# Altium project AuxPowerSupply.PrjPcb (part 3 of 3)

## Sheet OverCurrent_Indicators.SchDoc: Overcurrent Protection
size A4; CheckedBy: G.Kasprowicz; Author: M.Gaska; CompanyName: WUT ISE; DrawnBy: M.Gaska; Organization: WUT ISE; Address1: PW ISE; Address2: Nowowiejska 15/19 00-665 Warsaw; Address3: michalgaska2@gmail.com; DocumentNumber: 8; Revision: 2.0; SheetNumber: 8; SheetTotal: 9; ModifiedBy: M. Fafara; CheckedDate: -; Title2: v2.0; DivGrp: WUT ISE; Designer: M.Gaska; ModifiedDate: -; ProjectName: Sensor Box
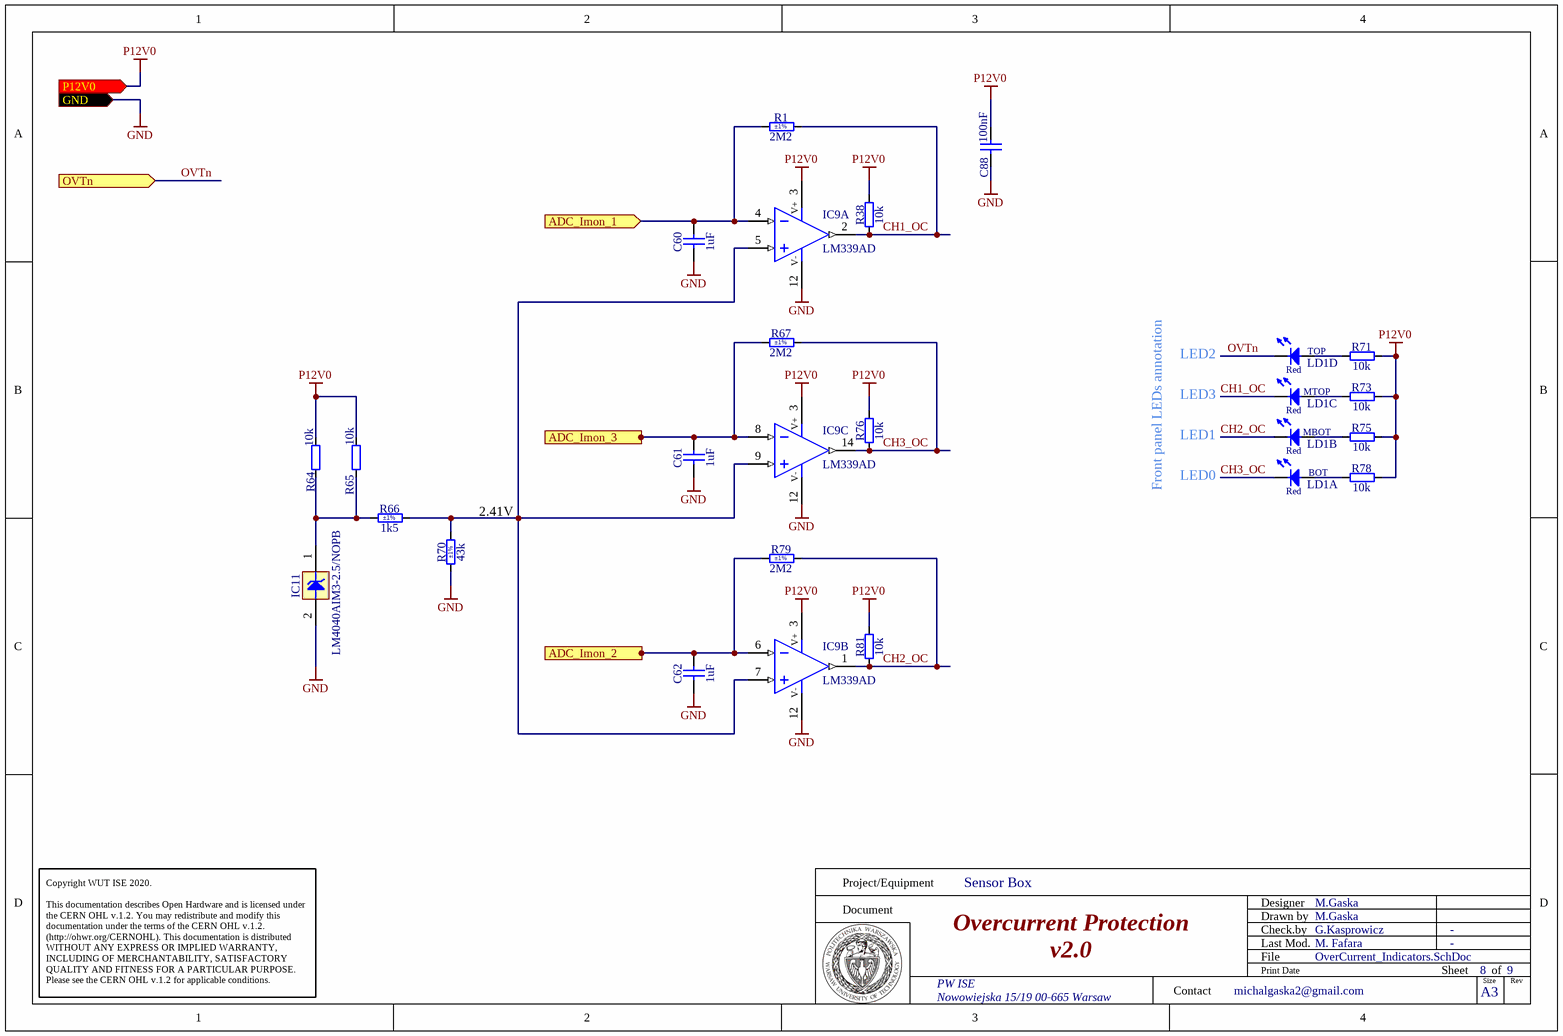
[diagram p5: OverCurrent_Indicators.SchDoc]

### Parts
C60  1uF  [CAPC1608X87N]
C61  1uF  [CAPC1608X87N]
C62  1uF  [CAPC1608X87N]
C88  100nF  [CAPC1608X87N]
IC9  LM339AD  [SOIC127P600X175-14N]  (parts A,B,C of 4)
IC11  LM4040AIM3-2.5/NOPB  [SOT95P251X112-3N]
LD1  (no value)  [LED_BIVAR_H485CHDL]  (parts A,B,C,D of 4)
R1  2M2  Tolerance: ±1%  [RESC1608X55N]
R38  10k  [RESC1608X55N]
R64  10k  [RESC1608X55N]
R65  10k  [RESC1608X55N]
R66  1k5  Tolerance: ±1%  [RESC1608X55N]
R67  2M2  Tolerance: ±1%  [RESC1608X55N]
R70  43k  Tolerance: ±1%  [RESC1608X55N]
R71  10k  [RESC1608X55N]
R73  10k  [RESC1608X55N]
R75  10k  [RESC1608X55N]
R76  10k  [RESC1608X55N]
R78  10k  [RESC1608X55N]
R79  2M2  Tolerance: ±1%  [RESC1608X55N]
R81  10k  [RESC1608X55N]

### Ports
ADC_Imon_1 (in), ADC_Imon_2 (in), ADC_Imon_3 (in), GND (in), OVTn (in), P12V0 (in)

### Nets
GND: C60.1 C61.1 C62.1 C88.1 IC9.12(V-) IC11.2(A) R70.1 ; port GND
P12V0: C88.2 IC9.3(V+) R38.2 R64.2 R65.2 R71.1 R73.1 R75.1 R76.2 R78.1 R81.2 ; port P12V0
ADC_Imon_1: C60.2 IC9.4(IN-) R1.1 ; port ADC_Imon_1
ADC_Imon_2: C62.2 IC9.6(IN-) R79.1 ; port ADC_Imon_2
ADC_Imon_3: C61.2 IC9.8(IN-) R67.1 ; port ADC_Imon_3
CH1_OC: IC9.2(OUT) LD1.5(C) R1.2 R38.1
CH2_OC: IC9.1(OUT) LD1.3(C) R79.2 R81.1
CH3_OC: IC9.14(OUT) LD1.1(C) R67.2 R76.1
OVTn: LD1.7(C) ; port OVTn
NetIC9_5: IC9.5(IN+) IC9.7(IN+) IC9.9(IN+) R66.2 R70.2
NetIC11_1: IC11.1(C) R64.1 R65.1 R66.1
NetLD1_2: LD1.2(A) R78.2
NetLD1_4: LD1.4(A) R75.2
NetLD1_6: LD1.6(A) R73.2
NetLD1_8: LD1.8(A) R71.2

### Notes on the sheet
- LED2
- LED1
- LED3
- (near R70) 2.41V
- Front panel LEDs annotation
- LED0
- Project/Equipment
- Document
- Designer
- Drawn by
- Check.by
- Copyright WUT ISE 2020.
  This documentation describes Open Hardware and is licensed under the CERN OHL v.1.2. You may redistribute and modify this documentation under the terms of the CERN OHL v.1.2. (http://ohwr.org/CERNOHL). This documentation is distributed WITHOUT ANY EXPRESS OR IMPLIED WARRANTY, INCLUDING OF MERCHANTABILITY, SATISFACTORY QUALITY AND FITNESS FOR A PARTICULAR PURPOSE. Please see the CERN OHL v.1.2 for applicable conditions.
- Contact
- File
- Last Mod.
- Print Date
- Sheet
- Size
- A3
- of
- Rev
- (in symbol LED_BIVAR_H485CHDL, part A) BOT; Red
- (in symbol LED_BIVAR_H485CHDL, part B) MBOT; Red
- (in symbol LED_BIVAR_H485CHDL, part C) MTOP; Red
- (in symbol LED_BIVAR_H485CHDL, part D) TOP; Red

### Library data of the parts
C60-C62 = CC0603_1UF_25V_10%_X7R: as C83 on sheet AuxPowerSupply; Part Number: CC0603_1UF_25V_10%_X7R; Component Kind: Standard; Component Type: Standard; Pin Count: 2; Value: 1uF; Status: None; Manufacturer Part Number: CC0603_1UF_25V_10%_X7R; Case: 0603; Mounted: Yes; Socket: No; SMD: Yes; Sense: No; Manufacturer1 Example: MURATA; Manufacturer1 ComponentHeight: 0.9mm; HelpURL: \\cern.ch\dfs\Applications\Altium\Datasheets\CC0603_X7R_MURATA.pdf; Author: CERN DEM JLC; CreateDate: 18.01.2011; LatestRevisionDate: 18.01.2011
C88 = CC0603_100NF_50V_10%_X7R: as C78 on sheet Negative_Rail; Part Number: CC0603_100NF_50V_10%_X7R; Component Kind: Standard; Component Type: Standard; Pin Count: 2; Value: 100nF; Status: Preferred; Manufacturer Part Number: CC0603_100NF_50V_10%_X7R; Case: 0603; Mounted: Yes; Socket: No; SMD: Yes; Sense: No; Manufacturer1 Example: PHYCOMP; Manufacturer1 ComponentHeight: 0.87mm; HelpURL: \\cern.ch\dfs\Applications\Altium\Datasheets\CC0603_X7R_PHYCOMP.pdf; Author: CERN DEM JLC; CreateDate: 03.12.2007; LatestRevisionDate: 03.12.2007
IC9 = LM339AD: Quad Operational Amplifier; Part Description: Quad Differential Comparator; Manufacturer: TEXAS INSTRUMENTS; PressFit: No; Bonding: No; Part Number: LM339AD; Component Kind: Standard; Component Type: Standard; Device: LM339AD; PackageDescription: SOIC 14, Pitch 1.27mm - Body 4x8.75mm, IPC Medium Density; Manufacturer Part Number: LM339AD; Pin Count: 14; Case: SOIC14; Mounted: Yes; Socket: No; SMD: Yes; Sense: No; ComponentHeight: 1.75mm; Author: CERN DEM JLC; HelpURL: \\cern.ch\dfs\Applications\Altium\Datasheets\LM339AD.pdf; CreateDate: 09.03.2011; LatestRevisionDate: 09.03.2011
IC11 = LM4040AIM3-2.5/NOPB: Precision Micropower Shunt Voltage Reference; Part Description: 2.5V ±0.1% 100 ppm/°C Precision Micropower Shunt Voltage Reference; Manufacturer: TEXAS INSTRUMENTS; PressFit: No; Bonding: No; Part Number: LM4040AIM3-2.5/NOPB; Component Kind: Standard; Component Type: Standard; Device: LM4040AIM3-2.5/NOPB; PackageDescription: SOT23 3-Leads, Pitch 0.95mm - Body 1.3x2.9mm, IPC Medium Density; Manufacturer Part Number: LM4040AIM3-2.5; Pin Count: 2; Case: SOT23; Mounted: Yes; Socket: No; SMD: Yes; Sense: No; ComponentHeight: 1.12mm; HelpURL: \\cern.ch\dfs\Applications\Altium\Datasheets\LM4040AIM3-2.5-NOPB.pdf; Author: CERN DEM JLC; CreateDate: 30.03.2010; LatestRevisionDate: 01.06.2022
LD1 = LED_BIVAR_H485CHDL: LED x4 Red 1C2A-BOT_3C4A_5C6A_7C8A-TOP; Part Description: Quad-Level 2mm HE Red LED, PCB Edge Mounting; Manufacturer: BIVAR; Color: HE Red; PressFit: No; Bonding: No; Part Number: LED_BIVAR_H485CHDL; Component Kind: Standard; Component Type: Standard; PackageDescription: Quad-Level 2mm HE Red, PCB Edge Mounting  BIVAR H485CHDL; Manufacturer Part Number: H485CHDL; Pin Count: 8; Mounted: Yes; Socket: No; SMD: No; Sense: No; ComponentHeight: 11.3mm; HelpURL: \\cern.ch\dfs\Applications\Altium\Datasheets\LED_BIVAR_H485CHDL.pdf; Author: CERN DEM JLC; CreateDate: 11.12.2008; LatestRevisionDate: 04.06.2012
R1 R67 R79 = R0603_2M2_1%_0.1W_100PPM: Resistor - 1%; Part Description: General Purpose Thick Film Chip Resistor; Manufacturer: GENERIC; Manufacturer1 Part Number: NRC06F2204TRF; Power: 0.1W; TC: ±100ppm/°C; PressFit: No; Part Number: R0603_2M2_1%_0.1W_100PPM; Component Kind: Standard; Component Type: Standard; Pin Count: 2; Value: 2M2; Status: Preferred; Manufacturer Part Number: R0603_2M2_1%_0.1W_100PPM; Case: 0603; Mounted: Yes; Sense: No; Socket: No; SMD: Yes; Manufacturer1 Example: NIC COMPONENT; Manufacturer1 ComponentHeight: 0.55mm; HelpURL: \\cern.ch\dfs\Applications\Altium\Datasheets\R0603_NIC_NRC.pdf; Author: CERN DEM JLC; CreateDate: 03.12.2007; LatestRevisionDate: 13.03.2008
R38 R64 R65 R71 R73 R75 R76 R78 R81 = R0603_10K_1%_0.1W_100PPM: as R19 on sheet AuxPowerSupply; Part Number: R0603_10K_1%_0.1W_100PPM; Component Kind: Standard; Component Type: Standard; Pin Count: 2; Value: 10k; Status: Preferred; Tolerance: ±1%; Manufacturer Part Number: R0603_10K_1%_0.1W_100PPM; Case: 0603; Mounted: Yes; Sense: No; Socket: No; SMD: Yes; Manufacturer1 Example: NIC COMPONENT; Manufacturer1 ComponentHeight: 0.55mm; HelpURL: \\cern.ch\dfs\Applications\Altium\Datasheets\R0603_NIC_NRC.pdf; Author: CERN DEM JLC; CreateDate: 03.12.2007; LatestRevisionDate: 13.03.2008
R66 = R0603_1K5_1%_0.1W_100PPM: Resistor - 1%; Part Description: General Purpose Thick Film Chip Resistor; Manufacturer: GENERIC; Manufacturer1 Part Number: NRC06F1501TRF; Power: 0.1W; TC: ±100ppm/°C; PressFit: No; Part Number: R0603_1K5_1%_0.1W_100PPM; Component Kind: Standard; Component Type: Standard; Pin Count: 2; Value: 1k5; Status: Preferred; Manufacturer Part Number: R0603_1K5_1%_0.1W_100PPM; Case: 0603; Mounted: Yes; Sense: No; Socket: No; SMD: Yes; Manufacturer1 Example: NIC COMPONENT; Manufacturer1 ComponentHeight: 0.55mm; HelpURL: \\cern.ch\dfs\Applications\Altium\Datasheets\R0603_NIC_NRC.pdf; Author: CERN DEM JLC; CreateDate: 03.12.2007; LatestRevisionDate: 13.03.2008
R70 = R0603_43K_1%_0.1W_100PPM: Resistor - 1%; Part Description: General Purpose Thick Film Chip Resistor; Manufacturer: GENERIC; Manufacturer1 Part Number: NRC06F4302TRF; Power: 0.1W; TC: ±100ppm/°C; PressFit: No; Part Number: R0603_43K_1%_0.1W_100PPM; Component Kind: Standard; Component Type: Standard; Pin Count: 2; Value: 43k; Status: Preferred; Manufacturer Part Number: R0603_43K_1%_0.1W_100PPM; Case: 0603; Mounted: Yes; Sense: No; Socket: No; SMD: Yes; Manufacturer1 Example: NIC COMPONENT; Manufacturer1 ComponentHeight: 0.55mm; HelpURL: \\cern.ch\dfs\Applications\Altium\Datasheets\R0603_NIC_NRC.pdf; Author: CERN DEM JLC; CreateDate: 03.12.2007; LatestRevisionDate: 13.03.2008

## Sheet Front_PowerConnectors.SchDoc: Front Power Connectors
size A4; CheckedBy: G.Kasprowicz; Author: M.Gaska; CompanyName: WUT ISE; DrawnBy: M.Gaska; Organization: WUT ISE; Address1: PW ISE; Address2: Nowowiejska 15/19 00-665 Warsaw; Address3: gkasprow@gmail.com; DocumentNumber: 9; Revision: 2.0; SheetNumber: 9; SheetTotal: 9; ModifiedBy: M. Fafara; CheckedDate: -; Title2: v2.0; DivGrp: WUT ISE; Designer: M.Gaska; ModifiedDate: -; ProjectName: Sensor Box
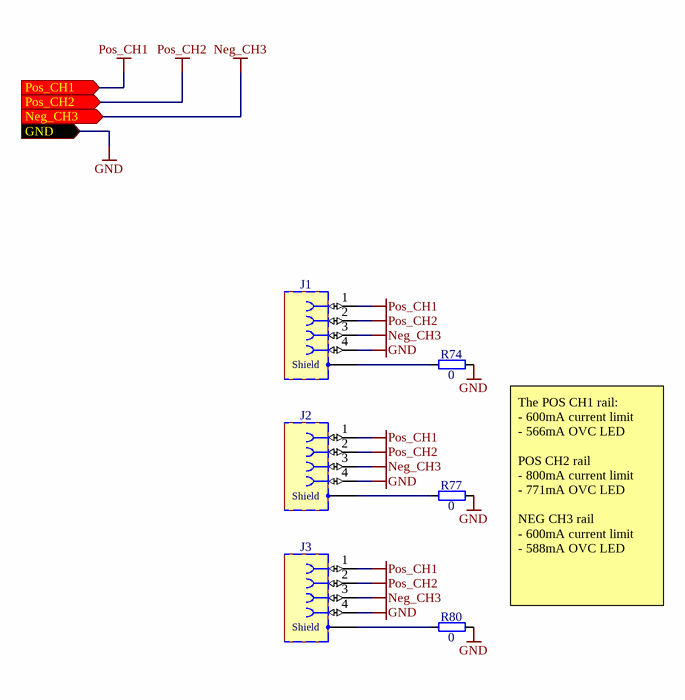
[diagram p6: Front_PowerConnectors.SchDoc]

### Parts
J1  M8  [AMPHENOL_M8AS-04PFFR-SF8001]  (value not drawn)
J2  M8  [AMPHENOL_M8AS-04PFFR-SF8001]  (value not drawn)
J3  M8  [AMPHENOL_M8AS-04PFFR-SF8001]  (value not drawn)
R74  0  [RESC1608X55N]
R77  0  [RESC1608X55N]
R80  0  [RESC1608X55N]

### Ports
GND (in), Neg_CH3 (in), Pos_CH1 (in), Pos_CH2 (in)

### Nets
GND: J1.4 J2.4 J3.4 R74.1 R77.1 R80.1 ; port GND
Neg_CH3: J1.3 J2.3 J3.3 ; port Neg_CH3
POS_CH1: J1.1 J2.1 J3.1 ; port Pos_CH1
POS_CH2: J1.2 J2.2 J3.2 ; port Pos_CH2
NetJ1_SHIELD: J1.SHIELD R74.2
NetJ2_SHIELD: J2.SHIELD R77.2
NetJ3_SHIELD: J3.SHIELD R80.2

### Notes on the sheet
- The POS CH1 rail:
  - 600mA current limit
  - 566mA OVC LED
  POS CH2 rail
  - 800mA current limit
  - 771mA OVC LED
  NEG CH3 rail
  - 600mA current limit
  - 588mA OVC LED
- Project/Equipment
- Document
- Designer
- Drawn by
- Check.by
- Copyright WUT ISE 2020.
  This documentation describes Open Hardware and is licensed under the CERN OHL v.1.2. You may redistribute and modify this documentation under the terms of the CERN OHL v.1.2. (http://ohwr.org/CERNOHL). This documentation is distributed WITHOUT ANY EXPRESS OR IMPLIED WARRANTY, INCLUDING OF MERCHANTABILITY, SATISFACTORY QUALITY AND FITNESS FOR A PARTICULAR PURPOSE. Please see the CERN OHL v.1.2 for applicable conditions.
- Contact
- File
- Last Mod.
- Print Date
- Sheet
- Size
- A3
- of
- Rev
- (in symbol AMPHENOL_M8AS-04PFFR-SF8001) Shield

### Library data of the parts
J1-J3 = AMPHENOL_M8AS-04PFFR-SF8001: Connector 4 Female + Shield; Part Description: 4 Contacts,  IP68 Sealing Level, Right Angled M8 Circular Receptacle; PressFit: No; Part Number: AMPHENOL_M8AS-04PFFR-SF8001; Component Kind: Standard; Component Type: Standard; Pin Count: 6; Family: M8; Mounted: Yes; Socket: No; SMD: No; Sense: No; Status: None; Manufacturer: AMPHENOL; Manufacturer Part Number: M8AS-04PFFR-SF8001; ComponentHeight: 12.65mm; HelpURL: \\cern.ch\dfs\Applications\Altium\Datasheets\AMPHENOL_M8AS-04PFFR-SF8001.pdf; Author: CERN DEM MR; CreateDate: 08.04.2019; LatestRevisionDate: 08.04.2019
R74 R77 R80 = R0603_0R_JUMPER: Resistor; Part Description: 1A (0.05R Max DC Resistance) Zero Ohm Jumper; Manufacturer: GENERIC; Manufacturer1 Part Number: NRC06Z0; PressFit: No; Part Number: R0603_0R_JUMPER; Component Kind: Standard; Component Type: Standard; Pin Count: 2; Value: 0; Status: Preferred; Manufacturer Part Number: R0603_0R_JUMPER; Case: 0603; Mounted: Yes; Sense: No; Socket: No; SMD: Yes; Manufacturer1 Example: NIC COMPONENT; Manufacturer1 ComponentHeight: 0.55mm; HelpURL: \\cern.ch\dfs\Applications\Altium\Datasheets\R0603_NIC_NRC.pdf; Author: CERN DEM JLC; CreateDate: 03.12.2007; LatestRevisionDate: 13.03.2008

## Sheet OverTempProtection.SchDoc: Over Temperature Protection
size A4; CheckedBy: G.Kasprowicz; Author: M.Gaska; CompanyName: WUT ISE; DrawnBy: M.Gaska; Organization: WUT ISE; Address1: PW ISE; Address2: Nowowiejska 15/19 00-665 Warsaw; Address3: michalgaska2@gmail.com; DocumentNumber: 8; Revision: 2.0; SheetNumber: 7; SheetTotal: 9; ModifiedBy: M. Fafara; CheckedDate: -; Title2: v2.0; DivGrp: WUT ISE; Designer: M.Gaska; ModifiedDate: -; ProjectName: Sensor Box
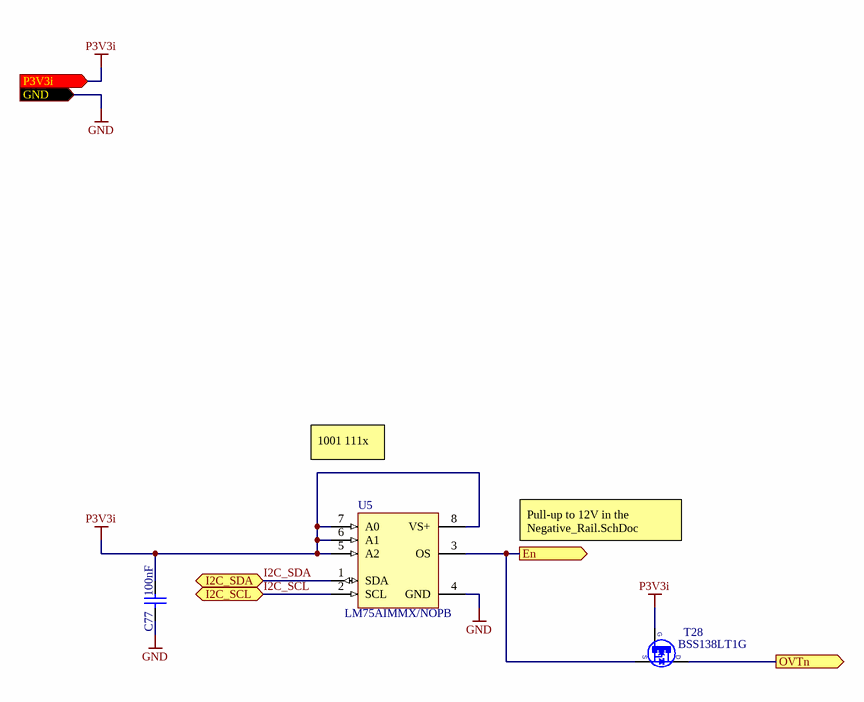
[diagram p7: OverTempProtection.SchDoc]

### Parts
C77  100nF  [CAPC1608X87N]
T28  BSS138LT1G  [SOT95P240X110-3N]
U5  LM75AIMMX/NOPB  [DGK0008A_M]

### Ports
En (out), GND (in), I2C_SCL (bidir), I2C_SDA (bidir), OVTn (out), P3V3i (in)

### Nets
GND: C77.1 U5.4(GND) ; port GND
P3V3i: C77.2 T28.1(G) U5.5(A2) U5.6(A1) U5.7(A0) U5.8(VS+) ; port P3V3i
En: T28.2(S) U5.3(OS) ; port En
I2C_SCL: U5.2(SCL) ; port I2C_SCL
I2C_SDA: U5.1(SDA) ; port I2C_SDA
OVTn: T28.3(D) ; port OVTn

### Notes on the sheet
- 1001 111x
- Pull-up to 12V in the Negative_Rail.SchDoc
- Project/Equipment
- Document
- Designer
- Drawn by
- Check.by
- Copyright WUT ISE 2020.
  This documentation describes Open Hardware and is licensed under the CERN OHL v.1.2. You may redistribute and modify this documentation under the terms of the CERN OHL v.1.2. (http://ohwr.org/CERNOHL). This documentation is distributed WITHOUT ANY EXPRESS OR IMPLIED WARRANTY, INCLUDING OF MERCHANTABILITY, SATISFACTORY QUALITY AND FITNESS FOR A PARTICULAR PURPOSE. Please see the CERN OHL v.1.2 for applicable conditions.
- Contact
- File
- Last Mod.
- Print Date
- Sheet
- Size
- A3
- of
- Rev

### Library data of the parts
C77 = CC0603_100NF_50V_10%_X7R: Non-polarised capacitor; Part Description: SMD Multilayer Chip Ceramic Capacitor; Manufacturer: GENERIC; Manufacturer1 Part Number: 223858615649; Voltage: 50V; TC: X7R; Tolerance: ±10%; Part Number: CC0603_100NF_50V_10%_X7R; Component Kind: Standard; Component Type: Standard; Pin Count: 2; Value: 100nF; Status: Preferred; Manufacturer Part Number: CC0603_100NF_50V_10%_X7R; Case: 0603; Mounted: Yes; Socket: No; SMD: Yes; Sense: No; Manufacturer1 Example: PHYCOMP; Manufacturer1 ComponentHeight: 0.87mm; HelpURL: \\cern.ch\dfs\Applications\Altium\Datasheets\CC0603_X7R_PHYCOMP.pdf; Author: CERN DEM JLC; CreateDate: 03.12.2007; LatestRevisionDate: 03.12.2007
T28 = BSS138LT1G: N-CHANNEL MOSFET WITH DIODE; Part Description: 50V, 200mA N-Channel Enhancement Mode Field-Effect Transistor; Manufacturer: ON SEMICONDUCTOR; PressFit: No; Bonding: No; Part Number: BSS138LT1G; Component Kind: Standard; Component Type: Standard; Device: BSS138LT1G; PackageDescription: SOT23, 0.95mm Pitch; 3 Pin, 1.40mm W X 3.00mm L X 1.10mm H body, IPC Medium Density; Manufacturer Part Number: BSS138L; Pin Count: 3; Case: SOT23-3; Mounted: Yes; Socket: No; SMD: Yes; Sense: No; ComponentHeight: 1.11mm; HelpURL: \\cern.ch\dfs\Applications\Altium\Datasheets\BSS138LT1G.pdf; Author: CERN DEM JLC; CreateDate: 23.03.2009; LatestRevisionDate: 25.05.2022
U5 = CMP-010-00652-1: Serial Switch/Digital Sensor, 9 Bit(s), 3Cel, Square, 8 Pin, Surface Mount; Sensor Type: TEMPERATURE SENSOR,SWITCH/DIGITAL OUTPUT,SERIAL; Min Supply Voltage: 2.7V; Max Supply Voltage: 5.5V; Min Operating Temperature: -55°C; Mounting Technology: Surface Mount; Pins: 8; RoHS Compliant: Yes; Max Operating Temperature: 125°C

## Sheet CPCIS_Connectors_P1.SchDoc: DIOT
size 420 x 297 mm; Author: G.Kasprowicz; CompanyName: WUT ISE; DrawnBy: G.Kasprowicz; Organization: WUT ISE; Address1: PW ISE; Address2: Nowowiejska 15/19 00-665 Warsaw; Address3: gkasprow@gmail.com; DocumentNumber: 9; Revision: 2.0; SheetNumber: 2; SheetTotal: 9; ModifiedBy: Marta Fafara; CheckedDate: -; Title2: connectors; DivGrp: WUT ISE; Designer: G.Kasprowicz; ModifiedDate: -; ProjectName: Sensor Box
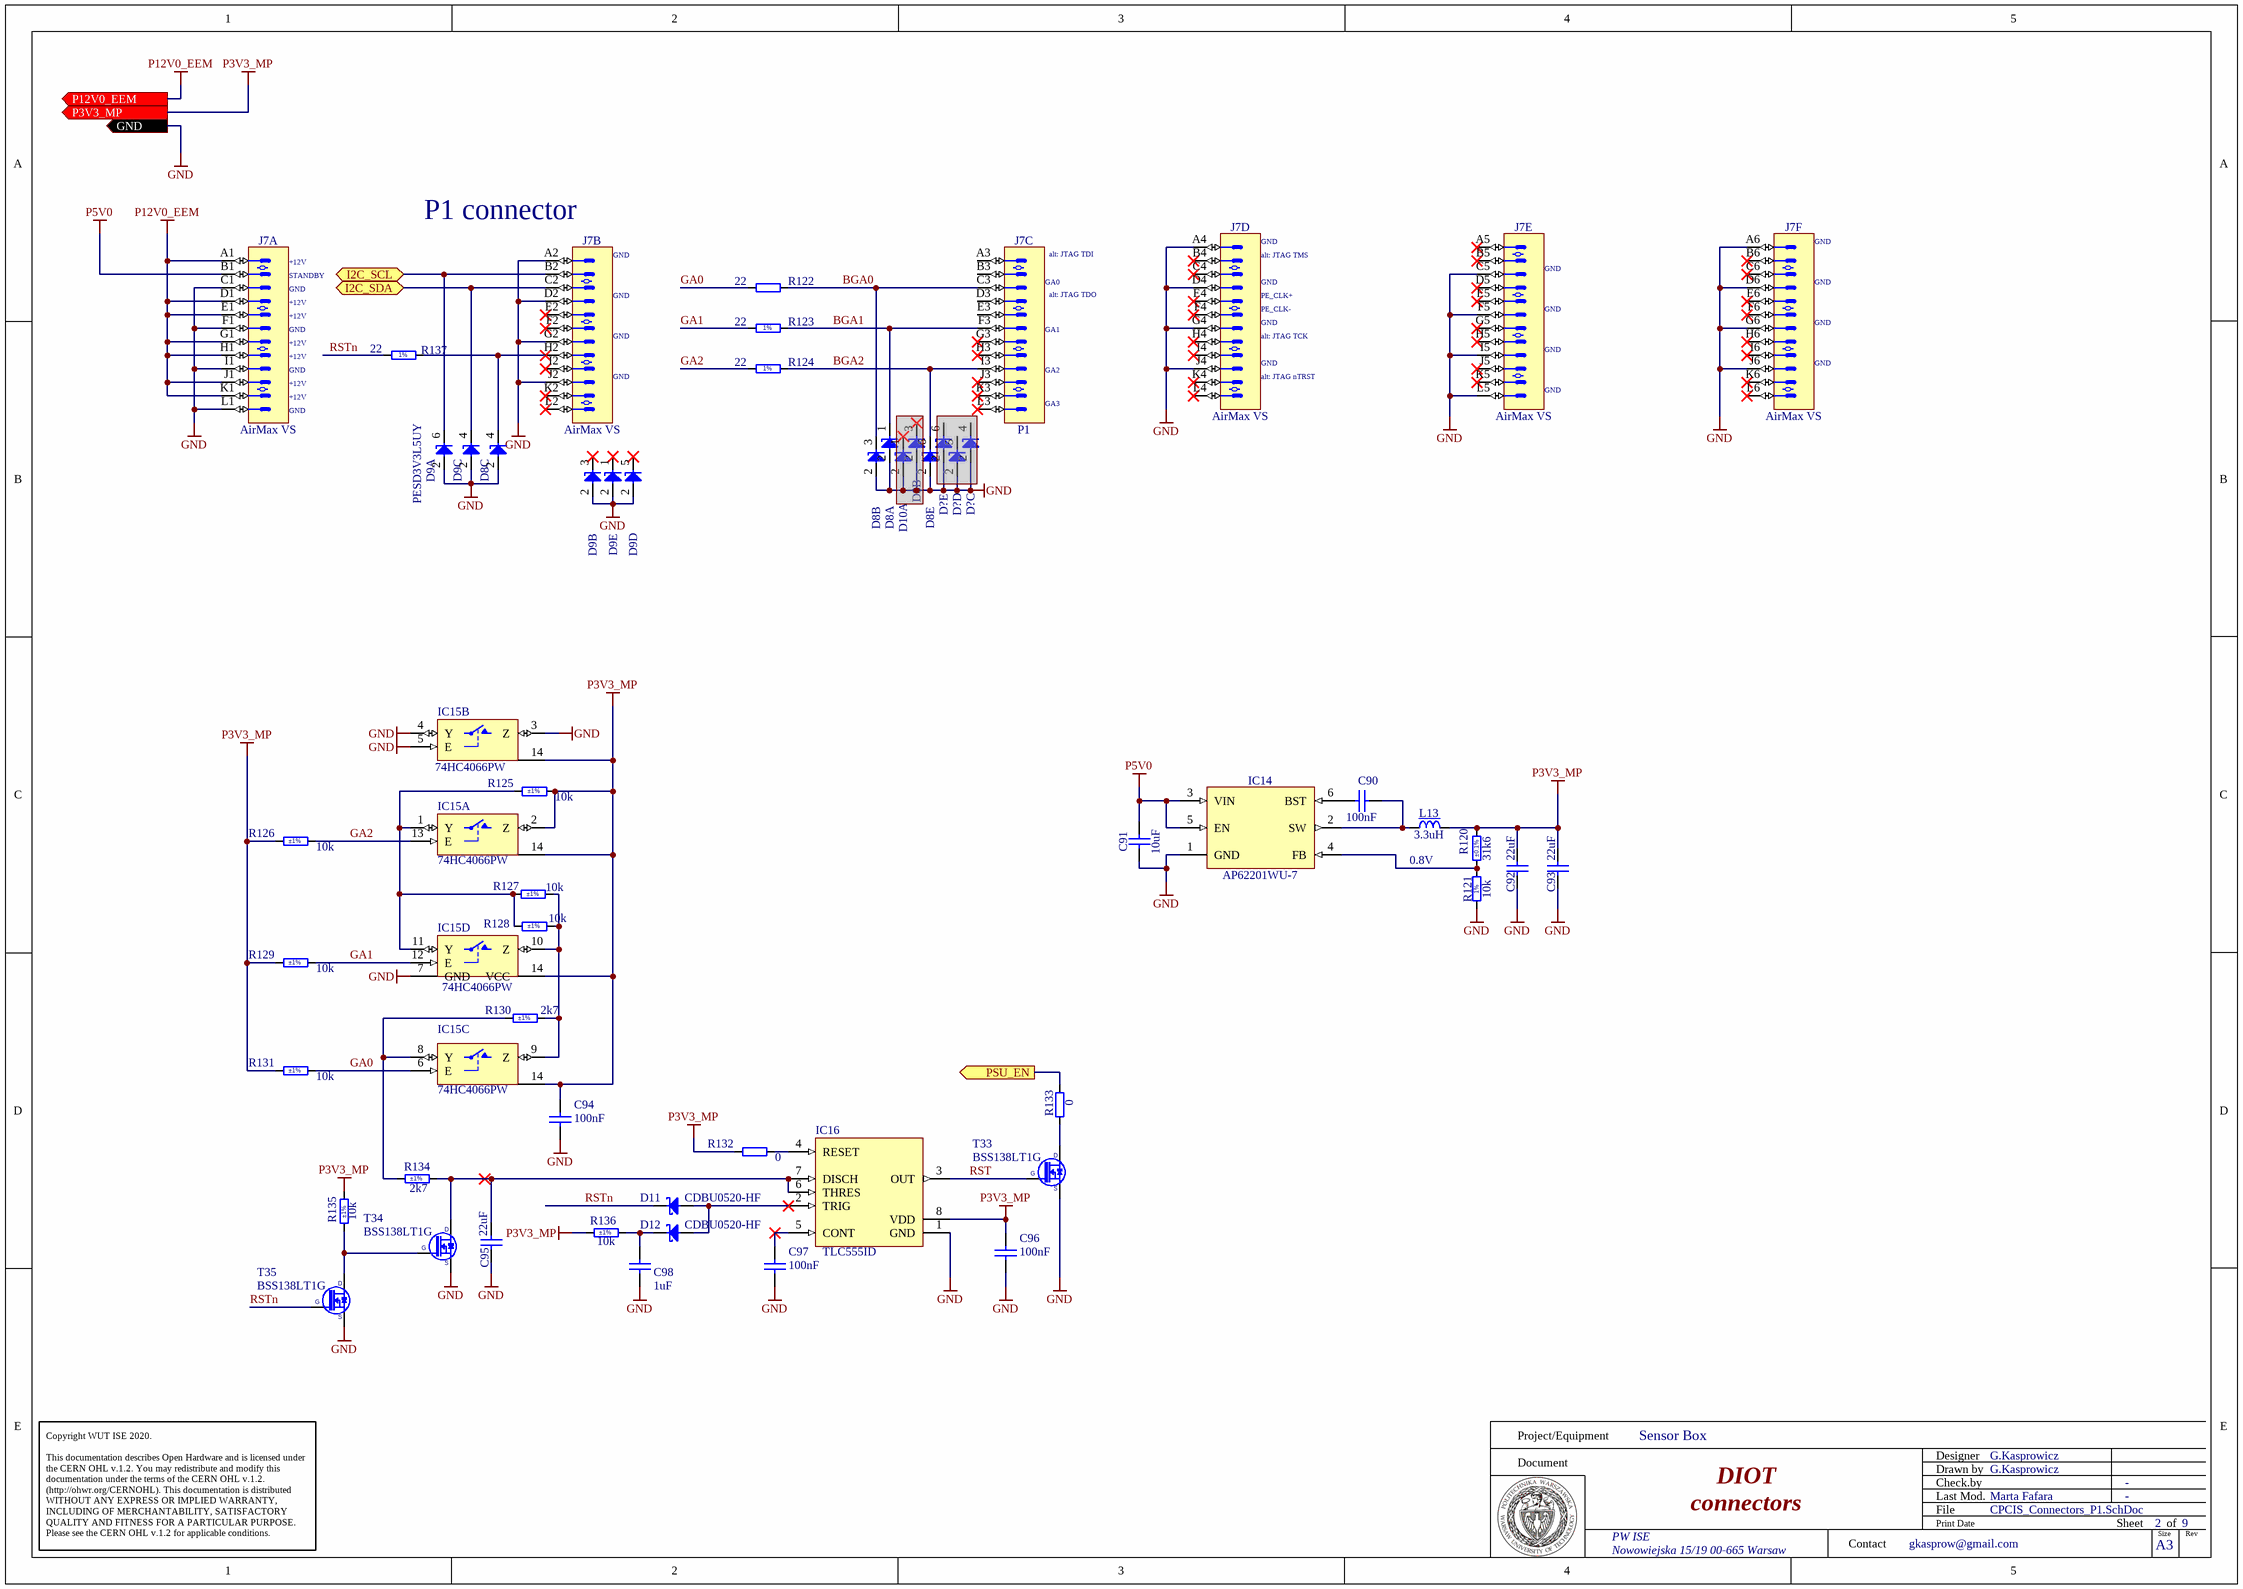
[diagram p8: CPCIS_Connectors_P1.SchDoc]

### Parts
(Parts that share a designator on the sheet are numbered #1, #2 ... from top to bottom, then left to right.)
C90  100nF  [CAPC1608X87N]
C91  10uF  [CAPC2012X135N]
C92  22uF  [CAPC2012X135N]
C93  22uF  [CAPC2012X135N]
C94  100nF  [CAPC1005X55N]
C95  22uF  [CAPC2012X135N]
C96  100nF  [CAPC1005X55N]
C97  100nF  [CAPC1005X55N]
C98  1uF  [CAPC1608X87N]
D8#1  PESD3V3L5UY  [SOT65P210X110-6N]  (value not drawn)  (parts A,B,C,E of 5)
D8#2  PESD3V3L5UY  [SOT65P210X110-6N]  (value not drawn)  (part B of 5)  (masked out: inside a compile mask, not in the netlist)
D9  PESD3V3L5UY  [SOT65P210X110-6N]  (value not drawn)  (parts A,B,C,D,E of 5)
D10  PESD3V3L5UY  [SOT65P210X110-6N]  (value not drawn)  (part A of 5)  (masked out: inside a compile mask, not in the netlist)
D11  CDBU0520-HF  [SOD-523F]
D12  CDBU0520-HF  [SOD-523F]
D?#1  PESD3V3L5UY  [SOT65P210X110-6N]  (value not drawn)  (part E of 5)  (masked out: inside a compile mask, not in the netlist)
D?#2  PESD3V3L5UY  [SOT65P210X110-6N]  (value not drawn)  (part C of 5)  (masked out: inside a compile mask, not in the netlist)
D?#3  PESD3V3L5UY  [SOT65P210X110-6N]  (value not drawn)  (part D of 5)  (masked out: inside a compile mask, not in the netlist)
IC14  AP62201WU-7  [SOT95P280X100-6N]
IC15  74HC4066PW  [SOP65P640X110-14N]  (parts A,B,C,D of 4)
IC16  TLC555ID  [SOIC127P600X175-8N]
J7  AirMax VS  [AMPHENOL_10052825-101LF]  (parts A,B,C,D,E,F of 6)
L13  3.3uH  [IND_WURTH_WE-TPC_4828]
R120  31k6  Tolerance: ±0.1%  [RESC1005X35N]
R121  10k  [RESC1005X40N]
R122  22  [RESC1005X40N]
R123  22  [RESC1005X40N]
R124  22  [RESC1005X40N]
R125  10k  Tolerance: ±1%  [RESC1608X55N]
R126  10k  Tolerance: ±1%  [RESC1608X55N]
R127  10k  Tolerance: ±1%  [RESC1608X55N]
R128  10k  Tolerance: ±1%  [RESC1608X55N]
R129  10k  Tolerance: ±1%  [RESC1608X55N]
R130  2k7  Tolerance: ±1%  [RESC1608X55N]
R131  10k  Tolerance: ±1%  [RESC1608X55N]
R132  0  [RESC1005X40N]
R133  0  [RESC1005X40N]
R134  2k7  Tolerance: ±1%  [RESC1608X55N]
R135  10k  Tolerance: ±1%  [RESC1608X55N]
R136  10k  Tolerance: ±1%  [RESC1608X55N]
R137  22  [RESC1005X40N]
T33  BSS138LT1G  [SOT95P240X110-3N]
T34  BSS138LT1G  [SOT95P240X110-3N]
T35  BSS138LT1G  [SOT95P240X110-3N]

### Ports
GND (out), I2C_SCL (bidir), I2C_SDA (bidir), P3V3_MP (out), P12V0_EEM (out), PSU_EN (out)

### Nets
GND: C91.1 C92.1 C93.1 C94.1 C95.1 C96.1 C97.1 C98.1 D8#1.2(A) D9.2(A) IC14.1(GND) IC15.3(Z) IC15.4(Y) IC15.5(E) IC15.7(GND) IC16.1(GND) J7.A2 J7.A4 J7.A6 J7.C1 J7.C5 J7.D2 J7.D4 J7.D6 J7.F1 J7.F5 J7.G2 J7.G4 J7.G6 J7.I1 J7.I5 J7.J2 J7.J4 J7.J6 J7.L1 J7.L5 R121.1 T33.2(S) T34.2(S) T35.2(S) ; port GND
P3V3_MP: C92.2 C93.2 C94.2 C96.2 IC15.2(Z) IC15.14(VCC) IC16.8(VDD) L13.2 R120.2 R125.2 R126.1 R129.1 R131.1 R132.1 R135.2 R136.1 ; port P3V3_MP
P5V0: C91.2 IC14.3(VIN) IC14.5(EN) J7.B1
P12V0_EEM: J7.A1 J7.D1 J7.E1 J7.G1 J7.H1 J7.J1 J7.K1 ; port P12V0_EEM
BGA0: D8#1.3(C) J7.C3 R122.2
BGA1: D8#1.1(C) J7.F3 R123.2
BGA2: D8#1.6(C) J7.I3 R124.2
En: R133.2 ; port PSU_EN
GA0: IC15.6(E) R122.1 R131.2
GA1: IC15.12(E) R123.1 R129.2
GA2: IC15.13(E) R124.1 R126.2
I2C_SCL: D9.6(C) J7.B2 ; port I2C_SCL
I2C_SDA: D9.4(C) J7.C2 ; port I2C_SDA
RST: IC16.3(OUT) T33.1(G)
RSTn: D11.1(C) R137.1 T35.1(G)
NetC90_1: C90.1 IC14.6(BST)
NetC90_2: C90.2 IC14.2(SW) L13.1
NetC95_2: C95.2 IC16.6(THRES) IC16.7(DISCH) R134.2 T34.3(D)
NetC97_2: C97.2 IC16.5(CONT)
NetC98_2: C98.2 D12.1(C) R136.2
NetD8#1_4: D8#1.4(C) J7.H2 R137.2
NetD11_2: D11.2(A) D12.2(A) IC16.2(TRIG)
NetIC14_4: IC14.4(FB) R120.1 R121.2
NetIC15_1: IC15.1(Y) IC15.11(Y) R125.1 R127.1 R128.1
NetIC15_8: IC15.8(Y) R130.1 R134.1
NetIC15_9: IC15.9(Z) IC15.10(Z) R127.2 R128.2 R130.2
NetIC16_4: IC16.4(RESET) R132.2
NetR133_1: R133.1 T33.3(D)
NetR135_1: R135.1 T34.1(G) T35.3(D)

Not connected (* = marked no-connect by the designer): D9 1(C)* 3(C)* 5(C)*; J7 A3 A5* B3 B4* B5* B6* C4* C6* D3 D5* E2* E3 E4* E5* E6* F2* F4* F6* G3* G5* H3* H4* H5* H6* I2* I4* I6* J3* J5* K2* K3* K4* K5* K6* L2* L3* L4* L6*

### Notes on the sheet
- (near J7) +12V
- (near J7) P1 connector
- (near J7) GND
- (near J7) alt: JTAG TDI
- (near J7) alt: JTAG TMS
- (near J7) STANDBY
- (near J7) GA0
- (near J7) alt: JTAG TDO
- (near J7) PE_CLK+
- (near J7) PE_CLK-
- (near J7) GA2
- (near J7) GA1
- (near J7) alt: JTAG TCK
- (near J7) alt: JTAG nTRST
- (near J7) GA3
- 0.8V
- Project/Equipment
- Document
- Designer
- Drawn by
- Check.by
- Copyright WUT ISE 2020.
  This documentation describes Open Hardware and is licensed under the CERN OHL v.1.2. You may redistribute and modify this documentation under the terms of the CERN OHL v.1.2. (http://ohwr.org/CERNOHL). This documentation is distributed WITHOUT ANY EXPRESS OR IMPLIED WARRANTY, INCLUDING OF MERCHANTABILITY, SATISFACTORY QUALITY AND FITNESS FOR A PARTICULAR PURPOSE. Please see the CERN OHL v.1.2 for applicable conditions.
- Contact
- File
- Last Mod.
- Print Date
- Sheet
- Size
- A3
- of
- Rev
- (in symbol R0402_10K_1%_0.0625W_100PPM) 1%
- (in symbol R0402_22R_1%_0.0625W_100PPM) 1%

### Library data of the parts
C90 = CC0603_100NF_50V_10%_X5R: Non-polarised capacitor; Part Description: SMD Multilayer Chip Ceramic Capacitor; Manufacturer: GENERIC; Manufacturer1 Part Number: C1608X5R1H104K080; Voltage: 50V; TC: X5R; Tolerance: ±10%; Part Number: CC0603_100NF_50V_10%_X5R; Component Kind: Standard; Component Type: Standard; Pin Count: 2; Value: 100nF; Status: None; Manufacturer Part Number: CC0603_100NF_50V_10%_X5R; Case: 0603; Mounted: Yes; Socket: No; SMD: Yes; Sense: No; Manufacturer1 Example: TDK; Manufacturer1 ComponentHeight: 0.9mm; HelpURL: \\cern.ch\dfs\Applications\Altium\Datasheets\CC0603_X5R_TDK_C.pdf; Author: CERN DEM MR; CreateDate: 08.01.2016; LatestRevisionDate: 08.01.2016
C91 = CC0805_10UF_10V_10%_X7R: Non-polarised capacitor; Part Description: SMD Multilayer Chip Ceramic Capacitor; Manufacturer: GENERIC; Manufacturer1 Part Number: GRM21BR71A106KE51L; Voltage: 10V; TC: X7R; Tolerance: ±10%; Part Number: CC0805_10UF_10V_10%_X7R; Component Kind: Standard; Component Type: Standard; Pin Count: 2; Value: 10uF; Status: Preferred; Manufacturer Part Number: CC0805_10UF_10V_10%_X7R; Case: 0805; Mounted: Yes; Socket: No; SMD: Yes; Sense: No; Manufacturer1 Example: MURATA; Manufacturer1 ComponentHeight: 1.35mm; HelpURL: \\cern.ch\dfs\Applications\Altium\Datasheets\CC0805_X7R_MURATA.pdf; Author: CERN DEM JLC; CreateDate: 30.04.2012; LatestRevisionDate: 30.04.2012
C92 C93 C95 = CC0805_22UF_16V_10%_X5R: Non-polarised capacitor; Part Description: SMD Multilayer Chip Ceramic Capacitor; Manufacturer: GENERIC; Manufacturer1 Part Number: C2012X5R1C226KT; Voltage: 16V; TC: X5R; Tolerance: ±10%; Part Number: CC0805_22UF_16V_10%_X5R; Component Kind: Standard; Component Type: Standard; Pin Count: 2; Value: 22uF; Status: Preferred; Manufacturer Part Number: CC0805_22UF_16V_10%_X5R; Case: 0805; Mounted: Yes; Socket: No; SMD: Yes; Sense: No; Manufacturer1 Example: TDK; Manufacturer1 ComponentHeight: 1.35mm; HelpURL: \\cern.ch\dfs\Applications\Altium\Datasheets\CC0805_X5R_TDK_C.pdf; Author: CERN DEM JLC; CreateDate: 25.10.2012; LatestRevisionDate: 25.10.2012
C94 C96 C97 = CC0402_100NF_50V_10%_X7R: Non-polarised capacitor; Part Description: SMD Multilayer Chip Ceramic Capacitor; Manufacturer: GENERIC; Manufacturer1 Part Number: GRM155R71H104KE14D; Voltage: 50V; TC: X7R; Tolerance: ±10%; Part Number: CC0402_100NF_50V_10%_X7R; Component Kind: Standard; Component Type: Standard; Pin Count: 2; Value: 100nF; Status: None; Manufacturer Part Number: CC0402_100NF_50V_10%_X7R; Case: 0402; Mounted: Yes; Socket: No; SMD: Yes; Sense: No; Manufacturer1 Example: MURATA; Manufacturer1 ComponentHeight: 0.55mm; HelpURL: \\cern.ch\dfs\Applications\Altium\Datasheets\CC0402_MURATA_GRM155R71H104KE14D.pdf; Author: CERN DEM MR; CreateDate: 30.06.2017; LatestRevisionDate: 30.06.2017
C98 = CC0603_1UF_25V_10%_X7R: Non-polarised capacitor; Part Description: SMD Multilayer Chip Ceramic Capacitor; Manufacturer: GENERIC; Manufacturer1 Part Number: GRM188R71E105KA12D; Voltage: 25V; TC: X7R; Tolerance: ±10%; Part Number: CC0603_1UF_25V_10%_X7R; Component Kind: Standard; Component Type: Standard; Pin Count: 2; Value: 1uF; Status: None; Manufacturer Part Number: CC0603_1UF_25V_10%_X7R; Case: 0603; Mounted: Yes; Socket: No; SMD: Yes; Sense: No; Manufacturer1 Example: MURATA; Manufacturer1 ComponentHeight: 0.9mm; HelpURL: \\cern.ch\dfs\Applications\Altium\Datasheets\CC0603_X7R_MURATA.pdf; Author: CERN DEM JLC; CreateDate: 18.01.2011; LatestRevisionDate: 18.01.2011
D8#1 D8#2 D9 D10 D?#1-D?#3 = PESD3V3L5UY: Fivefold ESD Protection Diode Arrays; Part Description: Fivefold ESD Protection Diode Arrays (30kV); Manufacturer: NEXPERIA; Voltage: 3.3V; Power: 200W; PressFit: No; Bonding: No; Part Number: PESD3V3L5UY; Component Kind: Standard; Component Type: Standard; Device: PESD3V3L5UY; PackageDescription: SOT363, SC-88, 0.65mm Pitch; 6 Pin, 1.25mm W X 2.00mm L X 1.10mm H body, IPC Medium Density; Manufacturer Part Number: PESD3V3L5UY; Pin Count: 6; Case: SOT363; Mounted: Yes; Socket: No; SMD: Yes; Sense: No; ComponentHeight: 1.1mm; HelpURL: \\cern.ch\dfs\Applications\Altium\Datasheets\PESD3V3L5UY.pdf; Author: CERN DEM WB; CreateDate: 05.07.2021; LatestRevisionDate: 05.07.2021
D11 D12 = CDBU0520-HF: Schottky Diode; Part Description: 20V Surface mount Schottky Barrier Diode; Manufacturer: COMCHIP; Voltage: 20V; Power: 500mA; PressFit: No; Bonding: No; Part Number: CDBU0520-HF; Component Kind: Standard; Component Type: Standard; Device: CDBU0520-HF; PackageDescription: Small Outline Diode Flat Lead (SOD-523F), Body; 1.80mm L X 1mm W X 0.85mm H; Manufacturer Part Number: CDBU0520-HF; Pin Count: 2; Case: SOD-523F; Mounted: Yes; Socket: No; SMD: Yes; Sense: No; ComponentHeight: 1mm; HelpURL: \\cern.ch\dfs\Applications\Altium\Datasheets\CDBU0520-HF.pdf; Author: CERN DEM HF; CreateDate: 13.10.2023; LatestRevisionDate: 13.10.2023
IC14 = AP62201WU-7: 4.2V TO 18V INPUT, 2A LOW IQ SYNCHRONOUS BUCK CONVERTER; Manufacturer: DIODES INCORPORATED; PressFit: No; Bonding: No; Part Number: AP62201WU-7; Component Kind: Standard; Component Type: Standard; Device: AP62201WU-7; PackageDescription: SOT23, 0.95mm Pitch; 6 Pin, 1.625mm W X 2.90mm L X 1.00mm H body, IPC Medium Density; Part Description: 4.2V To 18V Input, 2A Low Iq Synchronous Buck Converter; Manufacturer Part Number: AP62201WU; Pin Count: 6; Case: SOT23-6; Mounted: Yes; Socket: No; SMD: Yes; Sense: No; ComponentHeight: 1.1mm; HelpURL: \\cern.ch\dfs\Applications\Altium\Datasheets\AP6220x.pdf; Author: CERN DEM HF; CreateDate: 07.01.2022; LatestRevisionDate: 21.03.2022
IC15 = 74HC4066PW: Part Description: Quad Single-Pole Single-Throw Analog Switch; Manufacturer: NXP SEMICONDUCTORS; PressFit: No; Bonding: No; Table: Standard Logic; Part Number: 74HC4066PW; Component Kind: Standard; Component Type: Standard; Device: 74HC4066PW; PackageDescription: SOP, 14-Leads, Body 4.4x5mm (max), Pitch 0.65mm, IPC Medium Density; Manufacturer Part Number: 74HC4066PW; Pin Count: 14; Case: TSSOP14; Mounted: Yes; Socket: No; SMD: Yes; ComponentHeight: 1.1mm; Author: CERN DEM JLC; HelpURL: \\cern.ch\dfs\Applications\Altium\Datasheets\74HC4066PW.pdf; CreateDate: 2014-11-19; LatestRevisionDate: 2014-11-19
IC16 = TLC555ID: LinCMOS Timer; Manufacturer: TEXAS INSTRUMENTS; PressFit: No; Bonding: No; Part Number: TLC555ID; Component Kind: Standard; Component Type: Standard; Device: TLC555ID; PackageDescription: SOIC 8, Pitch 1.27mm, Body 4x5mm, IPC Medium Density; Part Description: LinCMOS Timer; Manufacturer Part Number: TLC555ID; Pin Count: 8; Case: SOIC8; Mounted: Yes; Socket: No; SMD: Yes; Sense: No; ComponentHeight: 1.75mm; Author: CERN DEM JMW; HelpURL: \\cern.ch\dfs\Applications\Altium\Datasheets\TLC555ID.pdf; CreateDate: 23.08.2016; LatestRevisionDate: 23.08.2016
J7 = AMPHENOL_10052825-101LF: 72 Contacts Header, 6 Columns, 4 Pairs per Column; Part Description: 72 Contacts, 2mm Pitch, 6 Columns, 4 Pairs per Column, 4 Walls, Right Angle Header; Part Number: AMPHENOL_10052825-101LF; Component Kind: Standard; Component Type: Standard; Pin Count: 72; Family: AirMax VS; Mounted: Yes; Socket: No; SMD: No; PressFit: Yes; Sense: No; Status: None; Manufacturer: AMPHENOL; Manufacturer Part Number: 10052825-101LF; ComponentHeight: 15.35mm; HelpURL: \\cern.ch\dfs\Applications\Altium\Datasheets\AMPHENOL_10052825-101LF.pdf; ComponentLink1URL: \\cern.ch\dfs\Applications\Altium\Datasheets\AMPHENOL_10052825-101LF_Application.pdf; ComponentLink1Description: Application; Author: CERN DEM MR; CreateDate: 19.02.2018; LatestRevisionDate: 19.02.2018; Classname: Overlapping
L13 = IND_3.3UH_30%_WURTH_WE-TPC_744043003: Inductor With Core; Part Description: Shielded Tiny Power Inductor (WE-TPC Serie); Manufacturer: WURTH ELEKTRONIK; Power: 2.15A; Resistance: 0.03R; Tolerance: ±30%; Part Number: IND_3.3UH_30%_WURTH_WE-TPC_744043003; Component Kind: Standard; Component Type: Standard; Pin Count: 2; Value: 3.3uH; Manufacturer Part Number: 744043003; Mounted: Yes; Socket: No; SMD: Yes; Sense: No; ComponentHeight: 3mm; HelpURL: \\cern.ch\dfs\Applications\Altium\Datasheets\IND_WURTH_WE-TPC_744043003.pdf; Author: CERN DEM JLC; CreateDate: 12.07.2011; LatestRevisionDate: 24.01.2012
R120 = R0402_31K6_0.1%_0.063W_25PPM_YAGEO_RT: Resistor - 0.1%; Part Description: Thin Film Chip Resistor; Manufacturer: YAGEO; Manufacturer Part Number: RT0402BRD0731K6L; Power: 0.063W; TC: ±25ppm/°C; Voltage: 50V; PressFit: No; Part Number: R0402_31K6_0.1%_0.063W_25PPM_YAGEO_RT; Component Kind: Standard; Component Type: Standard; Pin Count: 2; Value: 31k6; Status: Not Recommended; Case: 0402; Mounted: Yes; Sense: No; Socket: No; SMD: Yes; ComponentHeight: 0.35mm; HelpURL: \\cern.ch\dfs\Applications\Altium\Datasheets\R0402_YAGEO_RT.pdf; Author: CERN DEM BC; CreateDate: 30.07.2020; LatestRevisionDate: 30.07.2020
R121 = R0402_10K_1%_0.0625W_100PPM: Resistor - 1%; Part Description: General Purpose Thick Film Chip Resistor; Manufacturer: GENERIC; Manufacturer1 Part Number: 232270671003L; TC: ±100ppm/°C; PressFit: No; Part Number: R0402_10K_1%_0.0625W_100PPM; Component Kind: Standard; Component Type: Standard; Pin Count: 2; Value: 10k; Status: Not Recommended; Power: 0.0625W; Tolerance: ±1%; Manufacturer Part Number: R0402_10K_1%_0.0625W_100PPM; Case: 0402; Mounted: Yes; Sense: No; Socket: No; SMD: Yes; Manufacturer1 Example: YAGEO PHYCOMP; Manufacturer1 ComponentHeight: 0.4mm; HelpURL: \\cern.ch\dfs\Applications\Altium\Datasheets\R0402_Phycomp_RC0402.pdf; Author: CERN DEM JLC; CreateDate: 03.12.2007; LatestRevisionDate: 17.10.2012
R122-R124 R137 = R0402_22R_1%_0.0625W_100PPM: Resistor - 1%; Part Description: General Purpose Thick Film Chip Resistor; Manufacturer: GENERIC; Manufacturer1 Part Number: 232270672209L; PressFit: No; Part Number: R0402_22R_1%_0.0625W_100PPM; Component Kind: Standard; Component Type: Standard; Pin Count: 2; Value: 22; Status: Not Recommended; Power: 0.0625W; Tolerance: ±1%; Manufacturer Part Number: R0402_22R_1%_0.0625W_100PPM; Case: 0402; Mounted: Yes; Socket: No; SMD: Yes; Manufacturer1 Example: YAGEO PHYCOMP; Manufacturer1 ComponentHeight: 0.4mm; HelpURL: \\cern.ch\dfs\Applications\Altium\Datasheets\R0402_Phycomp_RC0402.pdf; Author: CERN DEM JLC; CreateDate: 03.12.2007; LatestRevisionDate: 17.10.2012; Sense: No
R125-R129 R131 R135 R136 = R0603_10K_1%_0.1W_100PPM: Resistor - 1%; Part Description: General Purpose Thick Film Chip Resistor; Manufacturer: GENERIC; Manufacturer1 Part Number: NRC06F1002TRF; Power: 0.1W; TC: ±100ppm/°C; PressFit: No; Part Number: R0603_10K_1%_0.1W_100PPM; Component Kind: Standard; Component Type: Standard; Pin Count: 2; Value: 10k; Status: Preferred; Manufacturer Part Number: R0603_10K_1%_0.1W_100PPM; Case: 0603; Mounted: Yes; Sense: No; Socket: No; SMD: Yes; Manufacturer1 Example: NIC COMPONENT; Manufacturer1 ComponentHeight: 0.55mm; HelpURL: \\cern.ch\dfs\Applications\Altium\Datasheets\R0603_NIC_NRC.pdf; Author: CERN DEM JLC; CreateDate: 03.12.2007; LatestRevisionDate: 13.03.2008
R130 R134 = R0603_2K7_1%_0.1W_100PPM: Resistor - 1%; Part Description: General Purpose Thick Film Chip Resistor; Manufacturer: GENERIC; Manufacturer1 Part Number: RC0603FR-072K7L; Power: 0.1W; TC: ±100ppm/°C; PressFit: No; Part Number: R0603_2K7_1%_0.1W_100PPM; Component Kind: Standard; Component Type: Standard; Pin Count: 2; Value: 2k7; Status: Preferred; Manufacturer Part Number: R0603_2K7_1%_0.1W_100PPM; Case: 0603; Mounted: Yes; Sense: No; Socket: No; SMD: Yes; Manufacturer1 Example: YAGEO PHYCOMP; Manufacturer1 ComponentHeight: 0.55mm; HelpURL: \\cern.ch\dfs\Applications\Altium\Datasheets\R0603_PHYCOMP_RC0603.pdf; Author: CERN DEM JLC; CreateDate: 02.05.2011; LatestRevisionDate: 02.05.2011
R132 R133 = R0402_0R_JUMPER: Resistor; Part Description: 1A (0.05R Max DC Resistance) Zero Ohm Jumper; Manufacturer: GENERIC; Manufacturer1 Part Number: 232270591001L; PressFit: No; Part Number: R0402_0R_JUMPER; Component Kind: Standard; Component Type: Standard; Pin Count: 2; Value: 0; Status: Not Recommended; Manufacturer Part Number: R0402_0R_JUMPER; Case: 0402; Mounted: Yes; Sense: No; Socket: No; SMD: Yes; Manufacturer1 Example: YAGEO PHYCOMP; Manufacturer1 ComponentHeight: 0.4mm; HelpURL: \\cern.ch\dfs\Applications\Altium\Datasheets\R0402_Phycomp_RC0402.pdf; Author: CERN DEM JLC; CreateDate: 03.12.2007; LatestRevisionDate: 17.10.2012
T33-T35 = BSS138LT1G: as T28 on sheet OverTempProtection; Part Number: BSS138LT1G; Component Kind: Standard; Component Type: Standard; Device: BSS138LT1G; PackageDescription: SOT23, 0.95mm Pitch; 3 Pin, 1.40mm W X 3.00mm L X 1.10mm H body, IPC Medium Density; Manufacturer Part Number: BSS138L; Pin Count: 3; Case: SOT23-3; Mounted: Yes; Socket: No; SMD: Yes; Sense: No; ComponentHeight: 1.11mm; HelpURL: \\cern.ch\dfs\Applications\Altium\Datasheets\BSS138LT1G.pdf; Author: CERN DEM JLC; CreateDate: 23.03.2009; LatestRevisionDate: 25.05.2022

## Nets that join several sheets
GND: AuxPowerSupply (27 pins), Negative_Rail (51 pins), Positive_Rail (79 pins), EEM_connector (15 pins), PowerConnectors (D4.2 FL1.4), OverCurrent_Indicators (7 pins), Front_PowerConnectors (6 pins), OverTempProtection (C77.1 U5.4), CPCIS_Connectors_P1 (40 pins)
N3V3: AuxPowerSupply (6 pins), Negative_Rail (8 pins)
Neg_CH3: Negative_Rail (C10.2 L2.2), Front_PowerConnectors (J1.3 J2.3 J3.3)
P3V3_MP: EEM_connector (D6.2 J4.30), CPCIS_Connectors_P1 (16 pins)
P3V3i: AuxPowerSupply (C58.2 C83.2 IC8.16), Negative_Rail (C65.2 C86.2 IC10.5), Positive_Rail (R26.2 R108.2), EEM_connector (8 pins), OverTempProtection (6 pins)
P12V0: AuxPowerSupply (6 pins), Negative_Rail (C5.2 C64.2 IC1.6 L3.1), Positive_Rail (C27.2 C44.2 L6.1 L9.1), EEM_connector (6 pins), PowerConnectors (D4.1 FL1.2), OverCurrent_Indicators (11 pins)
P12V0_EEM: EEM_connector (7 pins), CPCIS_Connectors_P1 (7 pins)
POS_CH1: Positive_Rail (C35.2 L7.2), Front_PowerConnectors (J1.1 J2.1 J3.1)
POS_CH2: Positive_Rail (C18.2 L4.2), Front_PowerConnectors (J1.2 J2.2 J3.2)
ADC_Imon_1: AuxPowerSupply (IC8.3), Positive_Rail (C73.2 R90.2), OverCurrent_Indicators (C60.2 IC9.4 R1.1)
ADC_Imon_2: AuxPowerSupply (IC8.5), Positive_Rail (C74.2 R91.2), OverCurrent_Indicators (C62.2 IC9.6 R79.1)
ADC_Imon_3: AuxPowerSupply (IC8.1), Negative_Rail (C70.2 R52.2), OverCurrent_Indicators (C61.2 IC9.8 R67.1)
CH1_NVout: AuxPowerSupply (IC8.6), Negative_Rail (C69.2 C87.2 IC10.4 R40.2)
CH1_PVout: AuxPowerSupply (IC8.7), Positive_Rail (C71.2 R44.1 R49.2)
CH2_PVout: AuxPowerSupply (IC8.8), Positive_Rail (C76.2 R50.1 R51.2)
En: Negative_Rail (IC2.1 R98.2 R111.2), Positive_Rail (IC3.1 IC5.1), OverTempProtection (T28.2 U5.3), CPCIS_Connectors_P1 (R133.2)
I2C_SCL: AuxPowerSupply (IC8.14), EEM_connector (D7.3 IC7.1 J4.27 TP2.1), OverTempProtection (U5.2), CPCIS_Connectors_P1 (D9.6 J7.B2)
I2C_SDA: AuxPowerSupply (IC8.15), EEM_connector (D7.2 IC7.3 J4.26 TP1.1), OverTempProtection (U5.1), CPCIS_Connectors_P1 (D9.4 J7.C2)
NetC72_2: AuxPowerSupply (IC8.2), Positive_Rail (C72.2 R84.2)
NetC75_2: AuxPowerSupply (IC8.4), Positive_Rail (C75.2 R92.2)
NetIC12_1: AuxPowerSupply (U2.7), Negative_Rail (IC12.1)
NetIC12_3: AuxPowerSupply (U2.6), Negative_Rail (IC12.3)
NetIC12_5: AuxPowerSupply (U2.4), Negative_Rail (IC12.5)
NetIC12_9: AuxPowerSupply (U2.1), Negative_Rail (IC12.9)
NetIC12_11: AuxPowerSupply (U2.2), Negative_Rail (IC12.11)
NetIC12_13: AuxPowerSupply (U2.15), Negative_Rail (IC12.13)
NetIC13_1: AuxPowerSupply (U2.14), Negative_Rail (IC13.1)
NetIC13_3: AuxPowerSupply (U2.3), Negative_Rail (IC13.3)
NetT1_1: AuxPowerSupply (U3.7), Positive_Rail (T1.1)
NetT2_1: AuxPowerSupply (U3.6), Positive_Rail (T2.1)
NetT3_1: AuxPowerSupply (U3.1), Positive_Rail (T3.1)
NetT4_1: AuxPowerSupply (U3.15), Positive_Rail (T4.1)
NetT5_1: AuxPowerSupply (U3.14), Positive_Rail (T5.1)
NetT6_1: AuxPowerSupply (U4.6), Positive_Rail (T6.1)
NetT7_1: AuxPowerSupply (U4.1), Positive_Rail (T7.1)
NetT8_1: AuxPowerSupply (U4.15), Positive_Rail (T8.1)
NetT9_1: AuxPowerSupply (U4.2), Positive_Rail (T9.1)
NetT21_1: AuxPowerSupply (U3.2), Positive_Rail (T21.1)
NetT22_1: AuxPowerSupply (U3.3), Positive_Rail (T22.1)
NetT23_1: AuxPowerSupply (U3.4), Positive_Rail (T23.1)
NetT24_1: AuxPowerSupply (U4.14), Positive_Rail (T24.1)
NetT25_1: AuxPowerSupply (U4.3), Positive_Rail (T25.1)
NetT26_1: AuxPowerSupply (U4.4), Positive_Rail (T26.1)
NetT27_1: AuxPowerSupply (U4.7), Positive_Rail (T27.1)
OVTn: OverCurrent_Indicators (LD1.7), OverTempProtection (T28.3)

## Assembly variants
Standard_pot_trim: all parts fitted